# EAGLE design T4p1_fpc_adapter (EAGLE 9.6.2)
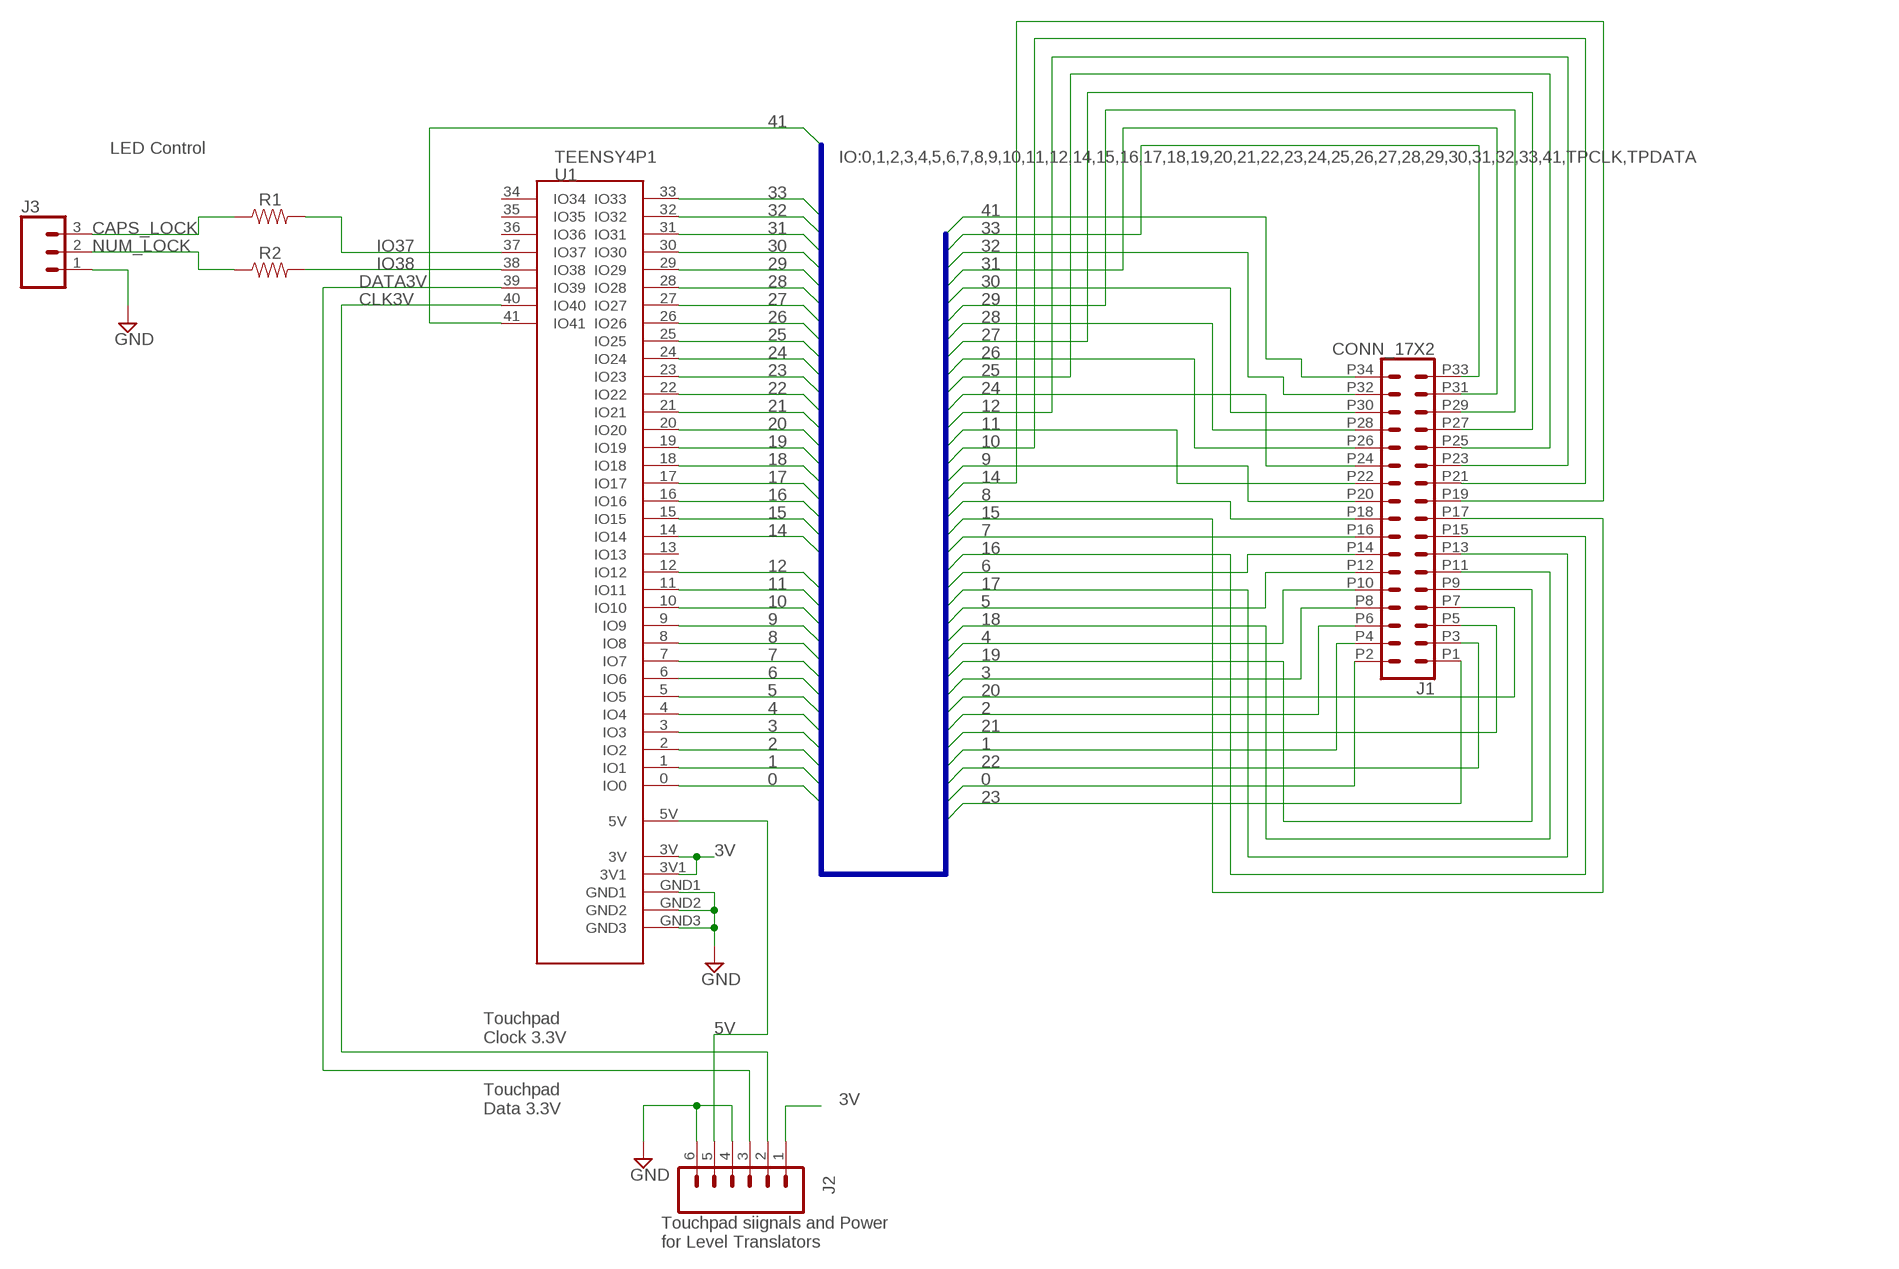
[diagram p0: schematic, sheet 1]

## Parts
J1  CONN_17X2  [2X17]
J2  CONN_06NO_SILK_FEMALE_PTH  [1X06_NO_SILK]
J3  CONN_031X03_NO_SILK  [1X03_NO_SILK]
R1  RESISTOR_AXIAL  [AXIAL-0.3]
R2  RESISTOR_AXIAL  [AXIAL-0.3]
U1  TEENSY4P1  TEENSYP41  [TEENSY4P1]

## Nets
0: J1.P2 U1.0(IO0)
1: J1.P4 U1.1(IO1)
2: J1.P6 U1.2(IO2)
3: J1.P8 U1.3(IO3)
3V: J2.1 U1.3V U1.3V1
4: J1.P10 U1.4(IO4)
5: J1.P12 U1.5(IO5)
5V: J2.5 U1.5V
6: J1.P14 U1.6(IO6)
7: J1.P16 U1.7(IO7)
8: J1.P18 U1.8(IO8)
9: J1.P20 U1.9(IO9)
10: J1.P21 U1.10(IO10)
11: J1.P22 U1.11(IO11)
12: J1.P23 U1.12(IO12)
14: J1.P19 U1.14(IO14)
15: J1.P17 U1.15(IO15)
16: J1.P15 U1.16(IO16)
17: J1.P13 U1.17(IO17)
18: J1.P11 U1.18(IO18)
19: J1.P9 U1.19(IO19)
20: J1.P7 U1.20(IO20)
21: J1.P5 U1.21(IO21)
22: J1.P3 U1.22(IO22)
23: J1.P1 U1.23(IO23)
24: J1.P24 U1.24(IO24)
25: J1.P25 U1.25(IO25)
26: J1.P26 U1.26(IO26)
27: J1.P27 U1.27(IO27)
28: J1.P28 U1.28(IO28)
29: J1.P29 U1.29(IO29)
30: J1.P30 U1.30(IO30)
31: J1.P31 U1.31(IO31)
32: J1.P32 U1.32(IO32)
33: J1.P33 U1.33(IO33)
41: J1.P34 U1.41(IO41)
CAPS_LOCK: J3.3 R1.P$1
CLK3V: J2.2 U1.40(IO40)
DATA3V: J2.3 U1.39(IO39)
GND: J2.4 J2.6 J3.1 U1.GND1 U1.GND2 U1.GND3
IO37: R1.P$2 U1.37(IO37)
IO38: R2.P$2 U1.38(IO38)
NUM_LOCK: J3.2 R2.P$1
Unconnected: U1.13(IO13) U1.34(IO34) U1.35(IO35) U1.36(IO36)

## Buses
IO:0,1,2,3,4,5,6,7,8,9,10,11,12,14,15,16,17,18,19,20,21,22,23,24,25,26,27,28,29,30,31,32,33,41,TPCLK,TPDATA

## Notes on the sheet
- LED Control
- Touchpad
  Clock 3.3V
- Touchpad
  Data 3.3V
- Touchpad siignals and Power
  for Level Translators

## Library data of the parts
J1 = CONN_17X2:CONN_17X2
J2 = SparkFun-Connectors:CONN_06: Multi connection point. Often used as Generic Header-pin footprint for 0.1 inch spaced/style header connections On any of the 0.1 inch spaced packages, you can populate with these: Break Away Headers - Straight <https://www.sparkfun.com/products/116> (PRT-00116) Break Away Male Headers - Right Angle <https://www.sparkfun.com/products/553> (PRT-00553) Female Headers <https://www.sparkfun.com/products/115> (PRT-00115) Break Away Headers - Machine Pin <https://www.sparkfun.com/products/117> (PRT-00117) Break Away Female Headers - Swiss Machine Pin <https://www.sparkfun.com/products/743> (PRT-00743) Arduino Stackable Header - 6 Pin <https://www.sparkfun.com/products/9280> (PRT-09280) For SCREWTERMINALS and SPRING TERMINALS visit here: Screw Terimnals on SparkFun.com <https://www.sparkfun.com/search/results?term=Screw+Terminals> (5mm/3.5mm/2.54mm spacing) This device is also useful as a general connection point to wire up your design to another part of your project. Our various solder wires solder well into these plated through hole pads. Hook-Up Wire - Assortment (Stranded, 22 AWG) <https://www.sparkfun.com/products/11375> (PRT-11375) Hook-Up Wire - Assortment (Solid Core, 22 AWG) <https://www.sparkfun.com/products/11367> (PRT-11367) View the entire wire category on our website here <https://www.sparkfun.com/categories/141>; PROD_ID: CONN-08437
J3 = SparkFun-Connectors:CONN_03: Multi connection point. Often used as Generic Header-pin footprint for 0.1 inch spaced/style header connections On any of the 0.1 inch spaced packages, you can populate with these: Break Away Headers - Straight <https://www.sparkfun.com/products/116> (PRT-00116) Break Away Male Headers - Right Angle <https://www.sparkfun.com/products/553> (PRT-00553) Female Headers <https://www.sparkfun.com/products/115> (PRT-00115) Break Away Headers - Machine Pin <https://www.sparkfun.com/products/117> (PRT-00117) Break Away Female Headers - Swiss Machine Pin <https://www.sparkfun.com/products/743> (PRT-00743) Stackable Header - 3 Pin (Female, 0.1") <https://www.sparkfun.com/products/13875> (PRT-13875) For SCREWTERMINALS and SPRING TERMINALS visit here: Screw Terimnals on SparkFun.com <https://www.sparkfun.com/search/results?term=Screw+Terminals> (5mm/3.5mm/2.54mm spacing) This device is also useful as a general connection point to wire up your design to another part of your project. Our various solder wires solder well into these plated through hole pads. Hook-Up Wire - Assortment (Stranded, 22 AWG) <https://www.sparkfun.com/products/11375> (PRT-11375) Hook-Up Wire - Assortment (Solid Core, 22 AWG) <https://www.sparkfun.com/products/11367> (PRT-11367) View the entire wire category on our website here <https://www.sparkfun.com/categories/141> Special notes: Molex polarized connector foot print use with SKU : PRT-08232 with associated crimp pins and housings.
R1 R2 = Resistor_Axial:RESISTOR_AXIAL
U1 = TEENSY4P1:TEENSYP41

## Board
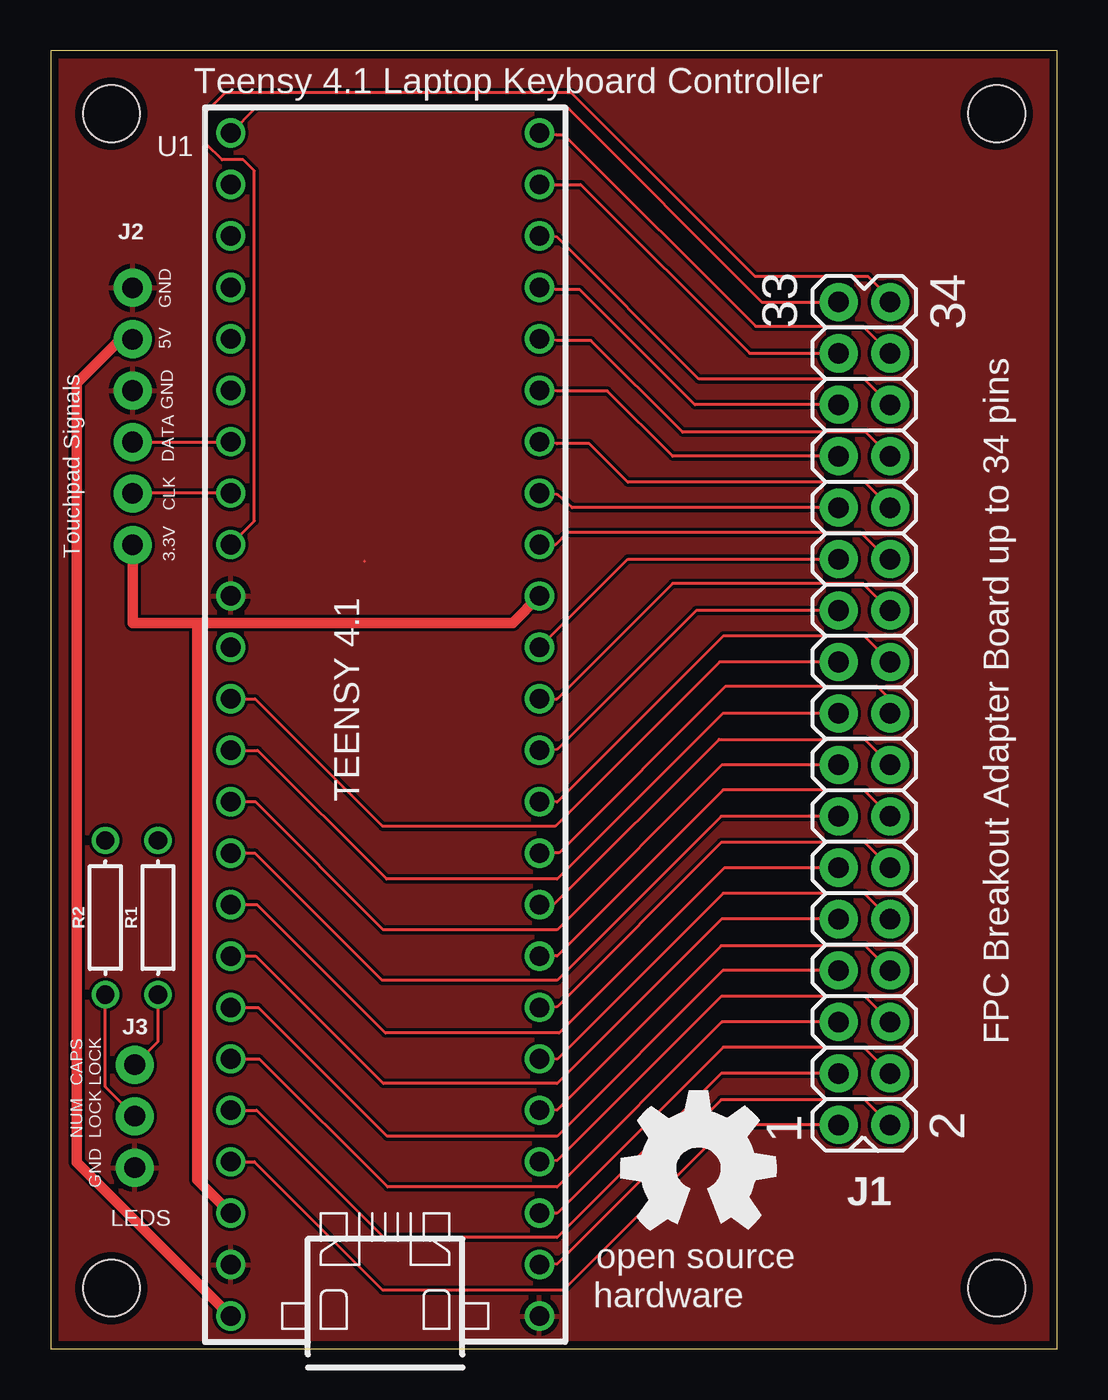
[diagram p1: board, top side]
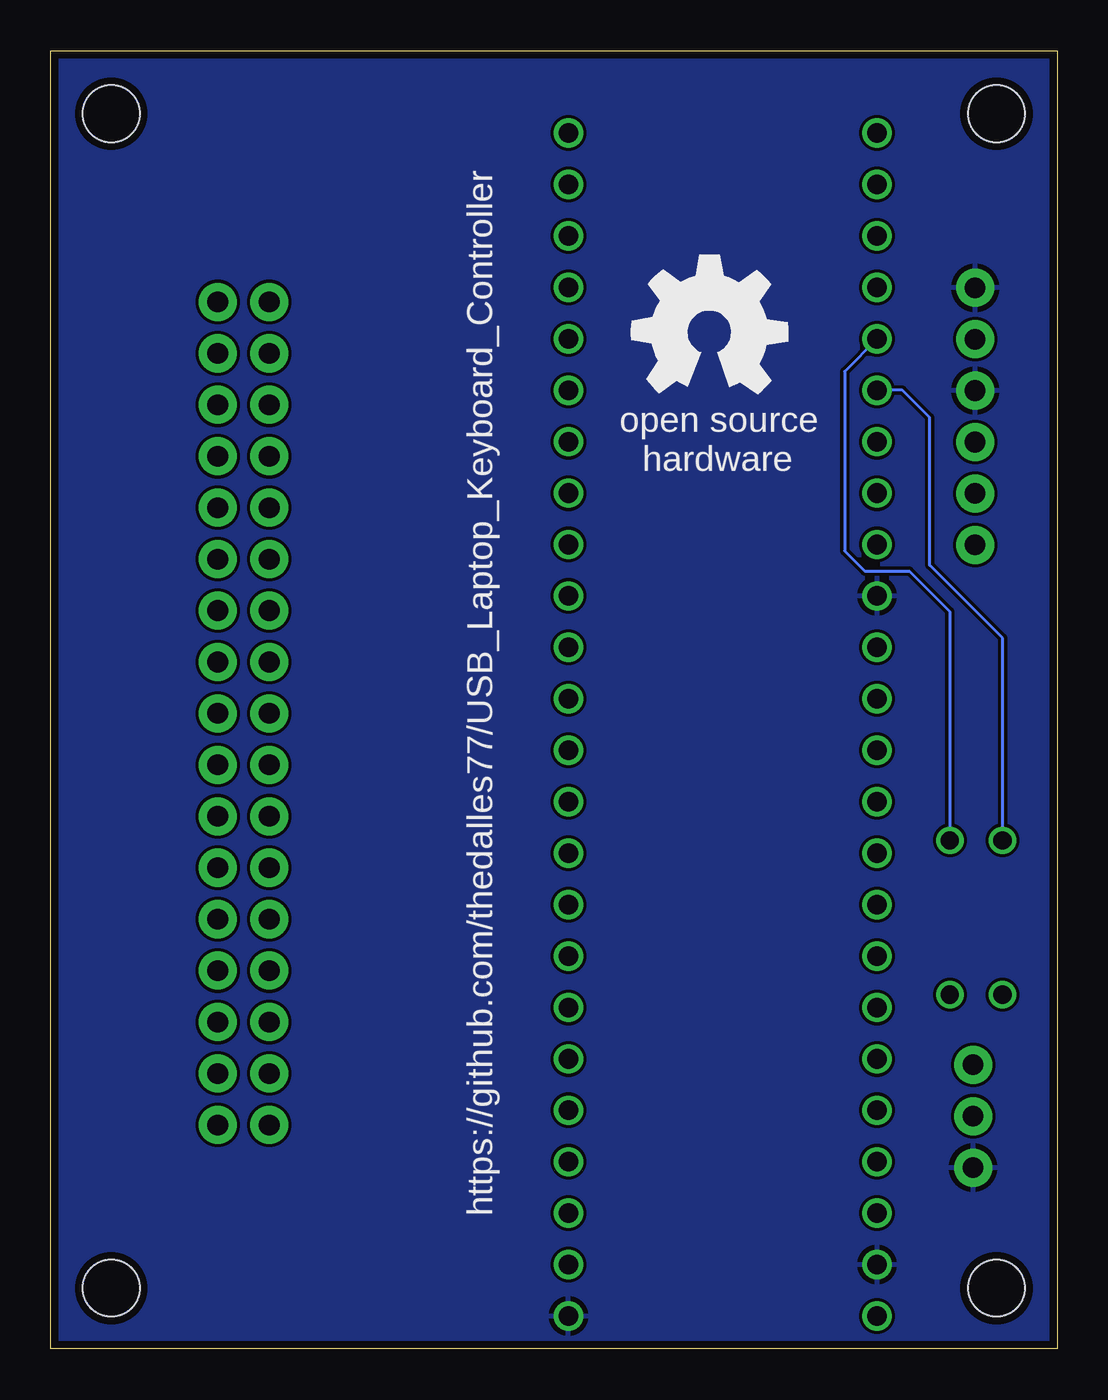
[diagram p2: board, bottom side, seen from below]

Size 49.69 x 64.11 mm. Coordinates in mm from the lower left corner, seen from the top.
Outline: 0,0 49.69,0 49.69,64.11 0,64.11 0,0
Copper layers (1*16): Top 0.035559375mm / dielectric 1.6mm / Bottom 0.035559375mm
Design rules "oshpark-2layer": minimum track width 6mil, minimum drill 10mil, track to track 6mil, track to pad 6mil, pad to pad 6mil, via to via 6mil, smd to smd 6mil, copper to edge 15mil, drill to drill 6mil, minimum pad ring 5mil, minimum via ring 5mil, stop-mask expansion 2.5mil, vias tented up to drill 0mil, thermal gap 10mil
Holes 2.8 mm at 3,3 46.7,3 46.7,61 3,61

### Footprints (pad centres in the part's own frame; a part is rotated, then mirrored left to right if it is on the bottom)
2X17 = drill 1.016 pad 1.88: P1 40.64,0; P2 40.64,2.54; P3 38.1,0; P4 38.1,2.54; P5 35.56,0; P6 35.56,2.54; P7 33.02,0; P8 33.02,2.54; P9 30.48,0; P10 30.48,2.54; P11 27.94,0; P12 27.94,2.54; P13 25.4,0; P14 25.4,2.54; P15 22.86,0; P16 22.86,2.54; P17 20.32,0; P18 20.32,2.54; P19 17.78,0; P20 17.78,2.54; P21 15.24,0; P22 15.24,2.54; P23 12.7,0; P24 12.7,2.54; P25 10.16,0; P26 10.16,2.54; P27 7.62,0; P28 7.62,2.54; P29 5.08,0; P30 5.08,2.54; P31 2.54,0; P32 2.54,2.54; P33 0,0; P34 0,2.54
1X06_NO_SILK = drill 1.016 pad 1.88: 1 0,0; 2 2.54,0; 3 5.08,0; 4 7.62,0; 5 10.16,0; 6 12.7,0
1X03_NO_SILK = drill 1.016 pad 1.88: 1 0,0; 2 2.54,0; 3 5.08,0
AXIAL-0.3 = drill 0.9: P$1 -3.81,0; P$2 3.81,0
TEENSY4P1 = drill 0.965: 0 -26.67,-6.35; 1 -24.13,-6.35; 2 -21.59,-6.35; 3 -19.05,-6.35; 3V -24.13,8.89; 3V1 6.35,-6.35; 4 -16.51,-6.35; 5 -13.97,-6.35; 5V -29.21,8.89; 6 -11.43,-6.35; 7 -8.89,-6.35; 8 -6.35,-6.35; 9 -3.81,-6.35; 10 -1.27,-6.35; 11 1.27,-6.35; 12 3.81,-6.35; 13 3.81,8.89; 14 1.27,8.89; 15 -1.27,8.89; 16 -3.81,8.89; 17 -6.35,8.89; 18 -8.89,8.89; 19 -11.43,8.89; 20 -13.97,8.89; 21 -16.51,8.89; 22 -19.05,8.89; 23 -21.59,8.89; 24 8.89,-6.35; 25 11.43,-6.35; 26 13.97,-6.35; 27 16.51,-6.35; 28 19.05,-6.35; 29 21.59,-6.35; 30 24.13,-6.35; 31 26.67,-6.35; 32 29.21,-6.35; 33 29.21,8.89; 34 26.67,8.89; 35 24.13,8.89; 36 21.59,8.89; 37 19.05,8.89; 38 16.51,8.89; 39 13.97,8.89; 40 11.43,8.89; 41 8.89,8.89; GND1 -29.21,-6.35; GND2 -26.67,8.89; GND3 6.35,8.89

### Placement (x,y rotation side)
J1  38.9,51.7 270 top
J2  4.05,39.7 90 top
J3  4.15,8.95 90 top
R1  5.3,21.3 90 top
R2  2.7,21.3 90 top
U1  17.78,30.83 90 top
U$1  [OSHW_8MM]  31.95,8.9 0 top
U$2  [OSHW_8MM]  17.15,50.2 0 top

### Tracks (layer width: path | path; a pad name or v marks a point on that pad's centre or on a via)
0
  Top 0.152: U1.0 25,4.2 33.1,12.3 40.2,12.3 J1.P2
1
  Top 0.152: U1.1 25,6.7 33.2,14.9 40.14,14.9 J1.P4
2
  Top 0.152: U1.2 25,9.3 33.1,17.4 40.18,17.4 J1.P6
3
  Top 0.152: U1.3 25,11.8 33.1,19.9 40.22,19.9 J1.P8
3V
  Top 0.508: U1.3V1 22.8,35.85 7.24,35.85 | U1.3V 7.24,8.35 7.24,35.85 | 7.24,35.85 4.05,35.85 J2.1
4
  Top 0.152: U1.4 25,14.3 33.2,22.5 40.16,22.5 J1.P10
5
  Top 0.152: U1.5 25,16.9 33.1,25 40.2,25 J1.P12
5V
  Top 0.508: U1.5V 1.3,9.21 1.3,47.7 3.46,49.86 J2.5
6
  Top 0.152: U1.6 25,19.4 33.2,27.6 40.2,27.6 40.2,27.54 J1.P14
7
  Top 0.152: J1.P16 40.18,30.1 32.99,30.1 24.84,21.94 U1.7
8
  Top 0.152: U1.8 25,24.5 25.1,24.5 33.3,32.7 40.8,32.7 41.44,32.06 J1.P18
9
  Top 0.152: U1.9 25,27 33.2,35.2 40.16,35.2 J1.P20
10
  Top 0.152: U1.10 25,29.6 31.86,36.46 J1.P21
11
  Top 0.152: U1.11 25,32.1 30.7,37.8 40.1,37.8 J1.P22
12
  Top 0.152: U1.12 28.49,39 J1.P23
14
  Top 0.152: U1.14 10.1,32.1 16.4,25.8 24.9,25.8 33.02,33.92 J1.P19
15
  Top 0.152: U1.15 10.22,29.56 16.58,23.2 25,23.2 33.18,31.38 J1.P17
16
  Top 0.152: U1.16 10.11,27.02 16.43,20.7 25,20.7 33.14,28.84 J1.P15
17
  Top 0.152: U1.17 10.08,24.48 16.36,18.2 25,18.2 33.1,26.3 J1.P13
18
  Top 0.152: U1.18 10.18,21.94 16.52,15.6 25.1,15.6 33.26,23.76 J1.P11
19
  Top 0.152: U1.19 10.12,19.4 16.42,13.1 25,13.1 33.12,21.22 J1.P9
20
  Top 0.152: U1.20 10.25,16.86 16.61,10.5 25,10.5 33.18,18.68 J1.P7
21
  Top 0.152: U1.21 10.31,14.32 16.63,8 25,8 33.14,16.14 J1.P5
22
  Top 0.152: U1.22 10.17,11.78 16.45,5.5 25,5.5 33.1,13.6 J1.P3
23
  Top 0.152: U1.23 10.06,9.24 16.4,2.9 25.3,2.9 33.46,11.06 J1.P1
24
  Top 0.152: U1.24 24.9,39.7 25.5,40.3 40,40.3 41.3,39 J1.P24
25
  Top 0.152: U1.25 25,42.2 25.74,41.54 J1.P25
26
  Top 0.152: U1.26 25,44.7 26.6,44.7 28.5,42.8 40.18,42.8 J1.P26
27
  Top 0.152: U1.27 25,47.3 27.48,47.3 30.7,44.08 J1.P27
28
  Top 0.152: U1.28 24.99,49.8 26.67,49.8 31.2,45.27 40.23,45.27 41.42,44.08 J1.P28
29
  Top 0.152: U1.29 24.91,52.31 26.11,52.31 31.8,46.62 J1.P29
30
  Top 0.152: U1.30 25,54.9 32,47.9 40.16,47.9 J1.P30
31
  Top 0.152: J1.P31 34.5,49.16 26.16,57.5 U1.31
32
  Top 0.152: U1.32 24.95,59.97 25.33,59.97 34.8,50.5 40.1,50.5 J1.P32
33
  Top 0.152: U1.33 10.18,61.33 25.47,61.33 35.1,51.7 J1.P33
41
  Top 0.152: U1.41 10.06,40.89 10.06,58.17 9.51,58.72 8.47,58.72 7.69,59.5 7.69,61.09 8.63,62.03 25.7,62.03 34.78,52.95 40.35,52.95 41.44,51.86 J1.P34
CAPS_LOCK
  Top 0.152: J3.3 5.3,15.18 R1.P$1
CLK3V
  Top 0.152: U1.40 4.07,42.26 J2.2
DATA3V
  Top 0.152: J2.3 8.87,44.78 U1.39
GND
  Top 0.152: 15.5,38.88 15.5,38.9
  pour Top: -0.01,0 -0.01,64.09 49.68,64.09 49.68,0
  pour Bottom: 0,0 0,64.1 49.7,64.1 49.7,0
IO37
  Bottom 0.152: U1.37 10.5,48.27 10.5,39.4 9.5,38.4 7.3,38.4 5.3,36.4 R1.P$2
IO38
  Bottom 0.152: R2.P$2 2.7,35.1 6.3,38.7 6.3,46 7.64,47.34 U1.38
NUM_LOCK
  Top 0.152: J3.2 2.7,12.94 R2.P$1

### Text on the board
tPlace: Teensy 4.1 Laptop Keyboard Controller | U1 | GND | 5V | GND | DATA | CLK | Touchpad Signals | 3.3V | FPC Breakout Adapter Board up to 34 pins | CAPS / LOCK | NUM / LOCK | GND | LEDS
bPlace: https://github.com/thedalles77/USB_Laptop_Keyboard_Controller